# Altium project HeatStick.PrjPcb
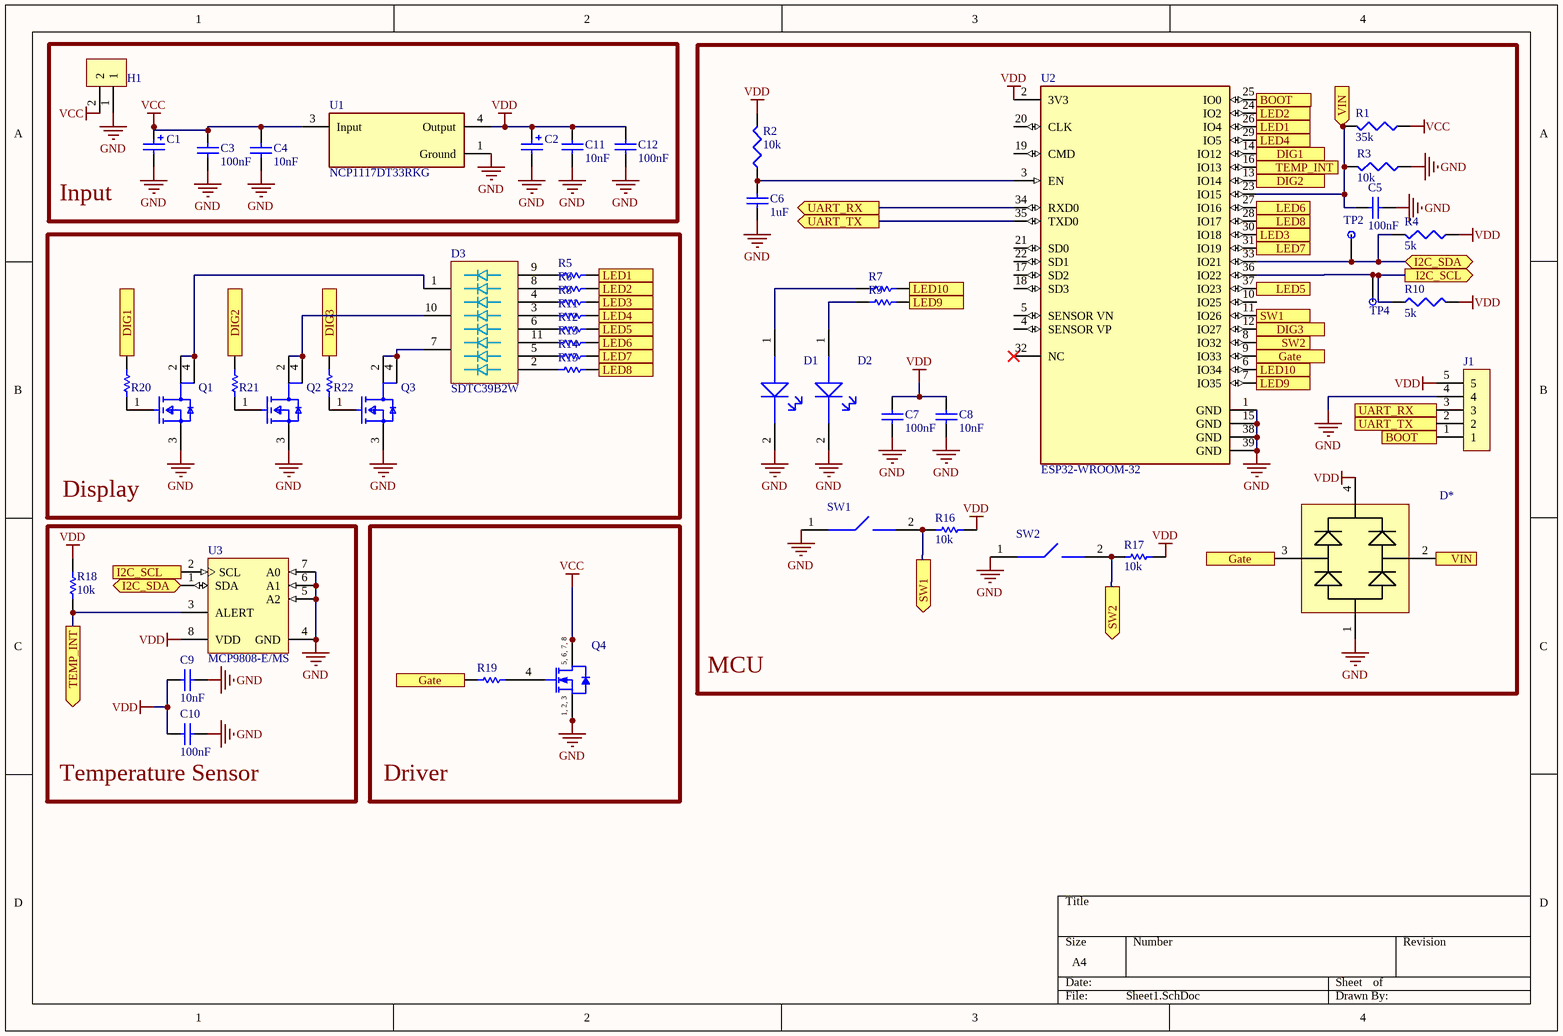
[diagram p0: Sheet1.SchDoc]
1 sheet, 51 parts. Net scope: flat (ports and power ports of the same name join across sheets).
Board file: PCB1.PcbDoc

## Sheet Sheet1.SchDoc
size A4; SheetNumber: 1; SheetTotal: 1

### Parts
C1  UBC1H470MNS1GS  [UBC1H470MNS1GS]  (value not drawn)
C2  UBC1H470MNS1GS  [UBC1H470MNS1GS]  (value not drawn)
C3  100nF  [RESC1005X03N]
C4  10nF  [RESC1005X03N]
C5  100nF  [RESC1005X03N]
C6  1uF  [RESC1005X03N]
C7  100nF  [RESC1005X03N]
C8  10nF  [RESC1005X03N]
C9  10nF  [RESC1005X03N]
C10  100nF  [RESC1005X03N]
C11  10nF  [RESC1005X03N]
C12  100nF  [RESC1005X03N]
D1  'LTST-C190KFKT  [RESC1608X04N]  (value not drawn)
D2  'LTST-C190KFKT  [RESC1608X04N]  (value not drawn)
D3  SDTC39B2W  [SDTC39B2W]
D*  DSL70E6327HTSA1  [SOT190P240X110-4N]  (value not drawn)
H1  H2P2.54  [Battery_12V]  (value not drawn)
J1  H5P1.27  [H5P1.27P]  (value not drawn)
Q1  ZXMN4A06GTA  [FP-SOT223-MFG]  (value not drawn)
Q2  ZXMN4A06GTA  [FP-SOT223-MFG]  (value not drawn)
Q3  ZXMN4A06GTA  [FP-SOT223-MFG]  (value not drawn)
Q4  BSC0906NS  [INF-PG-TDSON-8-1_V]  (value not drawn)
R1  35k  [RESC1005X03N]
R2  10k  [RESC1005X03N]
R3  10k  [RESC1005X03N]
R4  5k  [RESC1005X03N]
R5  RC0402FR-07150RL  [RESC1005X40X25ML05T10]  (value not drawn)
R6  RC0402FR-07150RL  [RESC1005X40X25ML05T10]  (value not drawn)
R7  RC0402FR-07150RL  [RESC1005X40X25ML05T10]  (value not drawn)
R8  RC0402FR-07150RL  [RESC1005X40X25ML05T10]  (value not drawn)
R9  RC0402FR-07150RL  [RESC1005X40X25ML05T10]  (value not drawn)
R10  5k  [RESC1005X03N]
R11  RC0402FR-07150RL  [RESC1005X40X25ML05T10]  (value not drawn)
R12  RC0402FR-07150RL  [RESC1005X40X25ML05T10]  (value not drawn)
R13  RC0402FR-07150RL  [RESC1005X40X25ML05T10]  (value not drawn)
R14  RC0402FR-07150RL  [RESC1005X40X25ML05T10]  (value not drawn)
R15  RC0402FR-07150RL  [RESC1005X40X25ML05T10]  (value not drawn)
R16  10k  [RESC1005X40X25ML5T10]
R17  10k  [RESC1005X40X25ML5T10]
R18  10k  [RESC1005X40X25ML5T10]
R19  RC0402FR-07150RL  [RESC1005X40X25ML05T10]  (value not drawn)
R20  RC0402FR-07150RL  [RESC1005X40X25ML05T10]  (value not drawn)
R21  RC0402FR-07150RL  [RESC1005X40X25ML05T10]  (value not drawn)
R22  RC0402FR-07150RL  [RESC1005X40X25ML05T10]  (value not drawn)
SW1  PTS815 SJK 250 SMTR LFS  [PTS815 SJK 250 SMTR LFS]  (value not drawn)
SW2  PTS815 SJK 250 SMTR LFS  [PTS815 SJK 250 SMTR LFS]  (value not drawn)
TP2  TESTPAD  [TESTPAD]  (value not drawn)
TP4  TESTPAD  [TESTPAD]  (value not drawn)
U1  NCP1117DT33RKG  [FP-369C-MFG]
U2  ESP32-WROOM-32  [FP-ESP32-WROOM-32-MFG]
U3  MCP9808-E/MS  [MCHP-MSOP-MS8_L]

### Blocks framed on the sheet
Input: C1-C4 C11 C12 H1 U1
MCU: C5-C8 D1 D2 D* J1 R1-R4 R7 R9 R10 R16 R17 SW1 SW2 TP2 TP4 U2
Display: D3 Q1-Q3 R5 R6 R8 R11-R15 R20-R22
Temperature Sensor: C9 C10 R18 U3
Driver: Q4 R19

### Ports
BOOT (in), BOOT (out), DIG1 (in), DIG1 (out), DIG2 (in), DIG2 (out), DIG3 (in), DIG3 (out), Gate (in), Gate (out), I2C_SCL (out), I2C_SDA (bidir), LED1 (in), LED1 (out), LED2 (in), LED2 (out), LED3 (in), LED3 (out), LED4 (in), LED4 (out), LED5 (in), LED5 (out), LED6 (in), LED6 (out), LED7 (in), LED7 (out), LED8 (in), LED8 (out), LED9 (in), LED9 (out), LED10 (in), LED10 (out), SW1 (in), SW1 (out), SW2 (in), SW2 (out), TEMP_INT (out), UART_RX (in), UART_RX (out), UART_TX (in), UART_TX (out), VIN (in)

### Nets
GND: C1.2 C2.2 C3.1 C4.1 C5.2 C6.2 C7.2 C8.2 C9.2 C10.2 C11.1 C12.1 D1.2 D2.2 D*.1 H1.1 J1.4 Q1.3(S) Q2.3(S) Q3.3(S) Q4.1(SOURCE) Q4.2(SOURCE) Q4.3(SOURCE) R3.1 SW1.1 SW2.1 U1.1(Ground) U2.1(GND) U2.15(GND) U2.38(GND) U2.39(GND) U3.4(GND) U3.5(A2) U3.6(A1) U3.7(A0)
VCC: C1.1 C3.2 C4.2 H1.2 Q4.5(DRAIN) Q4.6(DRAIN) Q4.7(DRAIN) Q4.8(DRAIN) R1.1 U1.3(Input)
VDD: C2.1 C7.1 C8.1 C9.1 C10.1 C11.2 C12.2 D*.4 J1.5 R2.2 R4.1 R10.2 R16.2 R17.2 R18.2 U1.4(Output) U2.2(3V3) U3.8(VDD)
NetC5_1: C5.1 D*.2 R1.2 R3.2 U2.23(IO15) ; port VIN
NetC6_1: C6.1 R2.1 U2.3(EN)
NetD1_1: D1.1 R7.1
NetD2_1: D2.1 R9.1
NetD3_1: D3.1 Q1.2(D) Q1.4(D)
NetD3_2: D3.2 R15.1
NetD3_3: D3.3 R11.1
NetD3_4: D3.4 R8.1
NetD3_5: D3.5 R14.1
NetD3_6: D3.6 R12.1
NetD3_7: D3.7 Q3.2(D) Q3.4(D)
NetD3_8: D3.8 R6.1
NetD3_9: D3.9 R5.1
NetD3_10: D3.10 Q2.2(D) Q2.4(D)
NetD3_11: D3.11 R13.1
NetD*_3: D*.3 R19.1 U2.9(IO33) ; port Gate
NetJ1_1: J1.1 U2.25(IO0) ; port BOOT
NetJ1_2: J1.2 U2.35(TXD0) ; port UART_TX
NetJ1_3: J1.3 U2.34(RXD0) ; port UART_RX
NetQ1_1: Q1.1(G) R20.2
NetQ2_1: Q2.1(G) R21.2
NetQ3_1: Q3.1(G) R22.2
NetQ4_4: Q4.4(GATE) R19.2
NetR4_2: R4.2 TP2.1 U2.33(IO21) U3.1(SDA) ; port I2C_SDA
NetR5_2: R5.2 U2.26(IO4) ; port LED1
NetR6_2: R6.2 U2.24(IO2) ; port LED2
NetR7_2: R7.2 U2.6(IO34) ; port LED10
NetR8_2: R8.2 U2.30(IO18) ; port LED3
NetR9_2: R9.2 U2.7(IO35) ; port LED9
NetR10_1: R10.1 TP4.1 U2.36(IO22) U3.2(SCL) ; port I2C_SCL
NetR11_2: R11.2 U2.29(IO5) ; port LED4
NetR12_2: R12.2 U2.37(IO23) ; port LED5
NetR13_2: R13.2 U2.27(IO16) ; port LED6
NetR14_2: R14.2 U2.31(IO19) ; port LED7
NetR15_2: R15.2 U2.28(IO17) ; port LED8
NetR16_1: R16.1 SW1.2 U2.11(IO26) ; port SW1
NetR17_1: R17.1 SW2.2 U2.8(IO32) ; port SW2
NetR18_1: R18.1 U2.16(IO13) U3.3(ALERT) ; port TEMP_INT
NetR20_1: R20.1 U2.14(IO12) ; port DIG1
NetR21_1: R21.1 U2.13(IO14) ; port DIG2
NetR22_1: R22.1 U2.12(IO27) ; port DIG3

Not connected (* = marked no-connect by the designer): U2 4(SENSOR_VP) 5(SENSOR_VN) 10(IO25) 17(SD2) 18(SD3) 19(CMD) 20(CLK) 21(SD0) 22(SD1) 32(NC)*

### Notes on the sheet
- (in symbol CMP-1090-00064-1) 5, 6, 7, 8; 1, 2, 3

### Library data of the parts
C3-C12 = CAP
D1 D2 = LED
Q1-Q3 = CMP-12801-000020-1: MOSFET N-CH 40V 5A SOT223; Manufacturer: Diodes Inc.; Rthja Max: 62.5°C/W; Gate To Source Voltage: 20V; Number Of Channels: 1; Standoff Height: 0.01mm; Automotive Grade: Grade 0; Threshold Vgs Max: 2V; Drain To Source Resistance: 0.05Ω; Reverse Recovery Charge: 16.36nC; Reverse Recovery Time: 19.86ns; Input Capacitace At Vds: 770pF @ 40V; Max Forward Diode Voltage: 0.95V; Depletion Mode: False; Power Dissipation: 2W; Turn Off Delay Time: 28.61ns; Typ Forward Diode Voltage: 0.8V; Threshold Vgs Min: 1V; Pulse Drain Current: 22A; Gate Charge At Vgs: 18.2nC @ 10V; Transconductance: 8.7S; Max Junction Temp: +150°C; Turn On Delay Time: 2.55ns; Device Class L2: Transistors; Digikey Description: MOSFET N-CH 40V 5A SOT223; Ipc Land Pattern Name: SOT230P700X180-4; ComponentLink2Description: Datasheet; Manufacturer Part Number: ZXMN4A06GTA; Automotive: Yes; ComponentLink2URL: https://www.diodes.com/assets/Datasheets/ZXMN4A06G.pdf; Drain To Source Breakdown Voltage: 40V; Package: SOT223; Temperature Range High: +150°C; Height: 1.8mm; Octopart: https://octopart.com/zxmn4a06gta-diodes+inc.-660114; Mouser Description: MOSFET 40V N-Chnl UMOS; Lead Free: Yes; Number Of N Channels: 1; Device Class L1: Discrete Semiconductors; Drain To Source Voltage: 40V; RoHS: TRUE; Category: Trans; Temperature: -55°C to +150°C; Device Class L3: MOSFETs; Continuous Drain Current: 5A; Temperature Range Low: -55°C; Footprint Url: https://www.diodes.com/assets/Package-Files/SOT223.pdf
Q4 = CMP-1090-00064-1: N-Channel OptiMOS Power-MOSFET, 30 V VDS, 63 A ID, -55 to 150 degC, PG-TDSON-8-1, Reel, Green; Manufacturer: Infineon; RthJC (max): 4.2Â K/W; RDS (on) (max): 4.5Â mOhm; IDpuls (max): 252Â A; QG: 6.7Â nC; Green: TRUE; VGS(th) (max): 2Â V; RthJA (max): 50Â K/W; Polarity: N; RDS (on) (max) (@4.5V): 6.4Â mOhm; ID (max): 63Â A; VDS (max): 30Â V; Ptot (max): 30Â W; VGS(th) (min): 1.2Â V; ComponentLink1Description: Manufacturer URL; Rth: 4.2Â K/W; ComponentLink3Description: Package Specification; ComponentLink2URL: http://www.infineon.com/dgdl/BSC0906NS_Rev+2.pdf?folderId=db3a304313b8b5a60113cee8763b02d7&fileId=db3a30433072cd8f0130986c816b2f8c; ComponentLink3URL: http://www.infineon.com/cms/packages/SMD_-_Surface_Mounted_Devices/P-PG-TDSON/P-PG-TDSON-08-01x_2x_3.html?__locale=en; DatasheetVersion: Rev. 2.0; PackageReference: PG-TDSON-8-1; Halogen-free: TRUE; PackageDescription: 8-Pin Plastic (Green) Thin Dual Small Outline Non-Leaded Package, 5.15 x 5.9 mm Body, 1.27 mm Pitch; Packing: Reel; PartNumber: BSC0906NS; Mounting Technology: Surface Mount; ComponentLink1URL: http://www.infineon.com/; ComponentLink2Description: Datasheet
R1-R4 R10 = RES
R5-R9 R11-R15 R19-R22 = CMP-2002-07401-1: Manufacturer: Yageo / Phycomp; Part Number: RC0402FR-07150RL
R16-R18 = CMP-2002-07915-2: 'RC0402JR-0710KL; Resistance: 10 kohm; Voltage Rating (DC): 50 V; Power Rating: 63 mW; Tolerance: 5%; Case\Package: 0402; RoHSCompliant: true; DatasheetVersion: Rev. 4, 02/2016; ComponentLink1Description: Manufacturer URL; PackageDescription: 2-Pin Surface Mount Device, Body 1 x 0.5 mm; Case Code (Imperial): 0402; PackageReference: 0402; ComponentLink1URL: http://www.yageo.com/; Mounting Technology: Surface Mount; REACH SVHC: No SVHC; ComponentLink2Description: Datasheet; Case Code (Metric): 1005; Width: 0.5 mm; Package Quantity: 10000; Packaging: Tape and Reel; Max Operating Temperature: 155 degC; Mount: Surface Mount; Length: 1 mm; ComponentLink2URL: http://www.yageo.com/documents/recent/PYu-RC_Group_51_RoHS_L_04.pdf; Height: 0.35 mm; Voltage Rating: 50 V; Pins: 2; Min Operating Temperature: -55 degC
U1 = CMP-07128-000036-1: IC REG LINEAR 3.3V 1A DPAK-3; Accuracy: 1%; Input Bias Current: 6mA; Min Input Voltage: 10V; Reference Voltage: 1.27V; Dropout Voltage: 1.07V; Number of Regulators: 1; Output Type: Fixed; Quiescent Current: 10mA; Max Input Voltage: 20V; Polarity: Positive; Packaging: Tape and Reel; Number of Pins: 3; Min Current Limit: 1A; Max Output Current: 1A; REACH SVHC: No SVHC; Nominal Output Voltage: 3.3V; Case/Package: DPAK; Min Output Voltage: 3.3V; Length: 6.73mm; Output Voltage Accuracy: 1%; Radiation Hardening: No; Min Operating Temperature: 0°C; Halogen Free: Halogen Free; Width: 6.22mm; Output Voltage: 3.3V; Height: 2.38mm; Lead Free: Lead Free; Output Current: 1A; Package Quantity: 1; Contact Plating: Tin; Number of Outputs: 1; Max Operating Temperature: 125°C; Mount: Surface Mount; Current Rating: 1A
U2 = CMP-194065-000008-1: RX TXRX MOD WIFI SURFACE MOUNT; Frequency: 2.5GHz; Sensitivity: -98dBm; Operating Supply Voltage: 3.6V; Data Rate: 150Mbps; Weight: 0.088185oz; Package Quantity: 550; Min Operating Temperature: -40°C; Mount: Surface Mount; Max Operating Temperature: 85°C; Packaging: Cut Tape; Case/Package: SMD/SMT
U3 = CMP-0192-00344-1: + / - 0.5 degC Maximum Accuracy Digital Temperature Sensor, 400 uA, 2.7 to 5.5 V, -40 to 125 degC, 8-pin MSOP (MS8), Tube; Manufacturer: Microchip; ComponentLink3Description: Package Specification; ComponentLink4URL: http://www.microchip.com/MCP9808; PackageDescription: 8-Lead Plastic Micro Small Outline Package, 3 x 3 mm Body, 0.65 mm Pitch; ComponentLink2Description: Datasheet; PartNumber: MCP9808-E/MS; Mounting Technology: Surface Mount; ComponentLink4Description: Product URL; ComponentLink1Description: Manufacturer URL; ComponentLink2URL: http://ww1.microchip.com/downloads/en/DeviceDoc/25095A.pdf; ComponentLink3URL: http://www.microchip.com/stellent/groups/techpub_sg/documents/packagingspec/en012702.pdf; DatasheetVersion: Rev. A; ComponentLink1URL: http://www.microchip.com; PackageReference: MSOP-MS8; PackageVersion: C04-111C